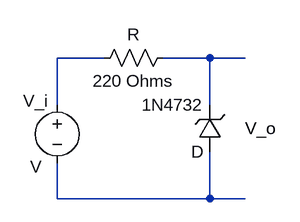
[diagram p0: schematic figure2.asc]
figure2.asc, the LTspice schematic file:
Version 4
SHEET 1 880 680
WIRE 128 64 64 64
WIRE 272 64 208 64
WIRE 320 64 272 64
WIRE 64 128 64 64
WIRE 272 128 272 64
WIRE 64 256 64 208
WIRE 272 256 272 192
WIRE 272 256 64 256
WIRE 320 256 272 256
SYMBOL voltage 64 112 R0
WINDOW 0 -46 11 Left 2
WINDOW 3 -37 101 Left 2
SYMATTR InstName V_i
SYMBOL res 224 48 R90
WINDOW 0 0 56 VBottom 2
WINDOW 3 32 56 VTop 2
SYMATTR InstName R
SYMATTR Value 220 Ohms
SYMBOL zener 288 192 R180
WINDOW 0 24 64 Left 2
WINDOW 3 24 0 Left 2
SYMATTR InstName 1N4732
TEXT 320 160 Left 2 !V_o

The netlist it stands for:
* figure2.asc
V_i N001 N003 V
R N002 N001 220 Ohms
D§1N4732 N003 N002 D
.model D D
.lib standard.dio
V_o
.backanno
.end